# EAGLE design Solenoid_con (EAGLE 7.7.0)
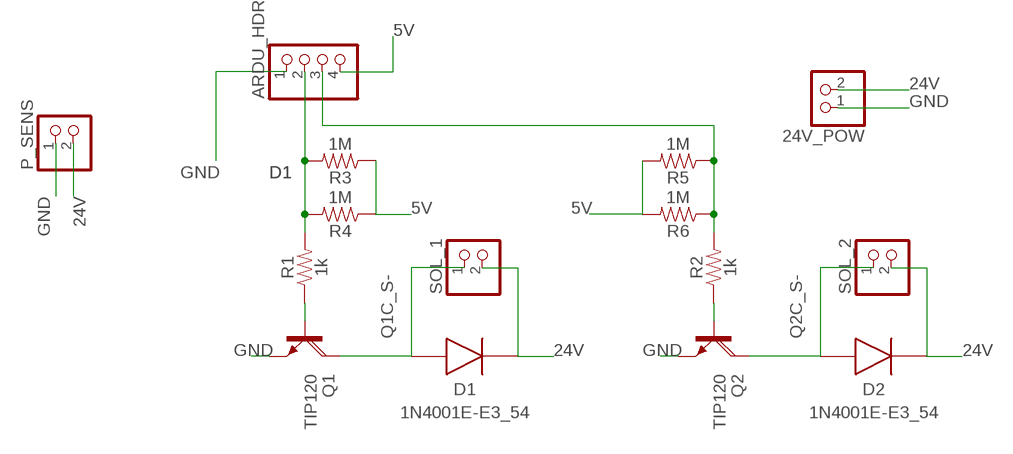
[diagram p0: schematic, sheet 1]

## Parts
24V_POW  PINHD-1X2  [1X02]
ARDU_HDR  PINHD-1X4  [1X04]
D1  1N4001E-E3_54  [DIOAD1405W86L465D235]
D2  1N4001E-E3_54  [DIOAD1405W86L465D235]
P_SENS  PINHD-1X2  [1X02]
Q1  TIP120  [TO220AH]
Q2  TIP120  [TO220AH]
R1  1k  1KOHM-HORIZ-1/4W-5%  [AXIAL-0.3]
R2  1k  1KOHM-HORIZ-1/4W-5%  [AXIAL-0.3]
R3  1M  1KOHM-HORIZ-1/4W-5%  [AXIAL-0.3]
R4  1M  1KOHM-HORIZ-1/4W-5%  [AXIAL-0.3]
R5  1M  1KOHM-HORIZ-1/4W-5%  [AXIAL-0.3]
R6  1M  1KOHM-HORIZ-1/4W-5%  [AXIAL-0.3]
SOL_1  PINHD-1X2  [1X02]
SOL_2  PINHD-1X2  [1X02]

## Nets
5V: ARDU_HDR.4 R3.P$1 R4.P$1 R5.P$2 R6.P$2
24V: 24V_POW.2 D1.2(K) D2.2(K) P_SENS.2 SOL_1.2 SOL_2.2
D1: ARDU_HDR.2 R1.P$2 R3.P$2 R4.P$2
D2: ARDU_HDR.3 R2.P$2 R5.P$1 R6.P$1
GND: 24V_POW.1 ARDU_HDR.1 P_SENS.1 Q1.E Q2.E
N$1: Q1.B R1.P$1
N$3: Q2.B R2.P$1
Q1C_S-: D1.1(A) Q1.C SOL_1.1
Q2C_S-: D2.1(A) Q2.C SOL_2.1

## Library data of the parts
24V_POW P_SENS SOL_1 SOL_2 = pinhead:PINHD-1X2: PIN HEADER
ARDU_HDR = pinhead:PINHD-1X4: PIN HEADER
D1 D2 = SamacSys_Parts:1N4001E-E3_54: Rectifiers Vr/50V Io/1A <https://componentsearchengine.com/Images/1/1N4001E-E3_54.jpg> Source: Datasheet <http://www.vishay.com/docs/88503/1n4001.pdf>; DESCRIPTION: Rectifiers Vr/50V Io/1A; HEIGHT: mm; MANUFACTURER_NAME: Vishay; MANUFACTURER_PART_NUMBER: 1N4001E-E3/54; SUPPLIER_NAME: RS
Q1 Q2 = transistor-power:TIP120: NPN DARLINGTON TRANSISTOR
R1 R2 = SparkFun-Resistors:1KOHM: 1kΩ resistor A resistor is a passive two-terminal electrical component that implements electrical resistance as a circuit element. Resistors act to reduce current flow, and, at the same time, act to lower voltage levels within circuits. - Wikipedia; PROD_ID: RES-08380
R3-R6 = SparkFun-Resistors:1KOHM: 1kΩ resistor A resistor is a passive two-terminal electrical component that implements electrical resistance as a circuit element. Resistors act to reduce current flow, and, at the same time, act to lower voltage levels within circuits. - Wikipedia; PROD_ID: RES-08380; VALUE: 1k

## Board
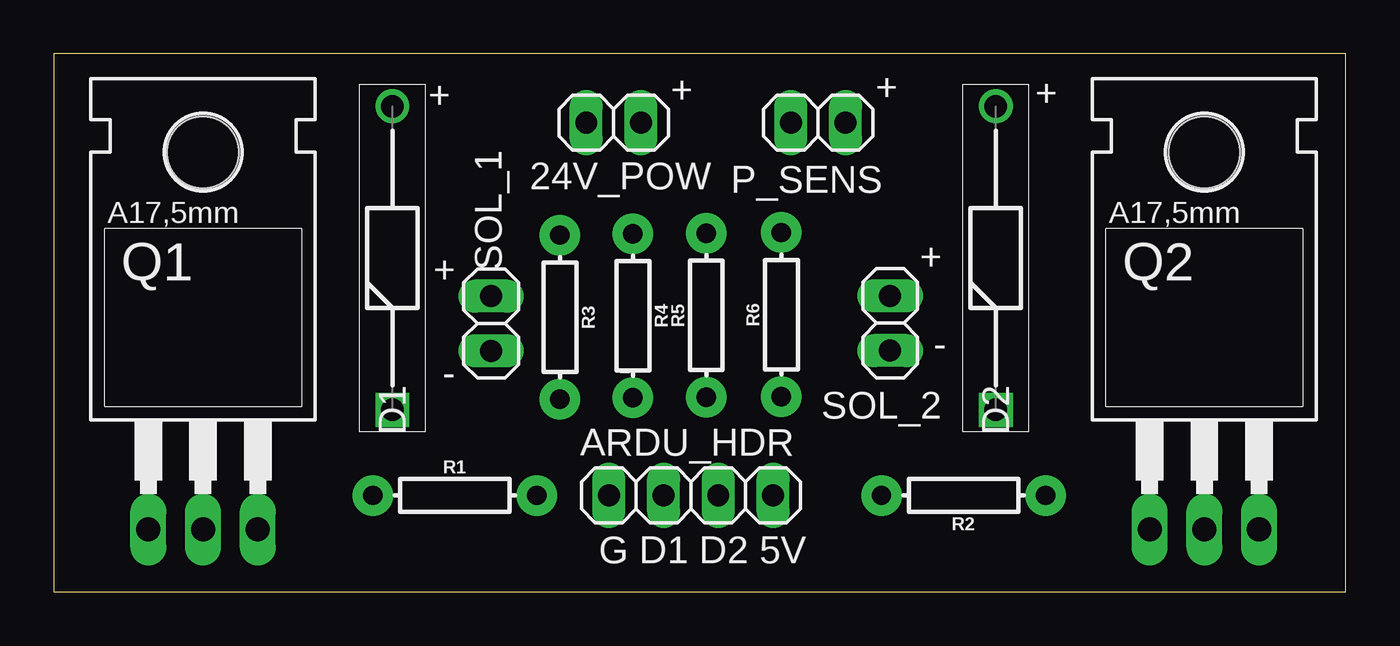
[diagram p1: board, top side]
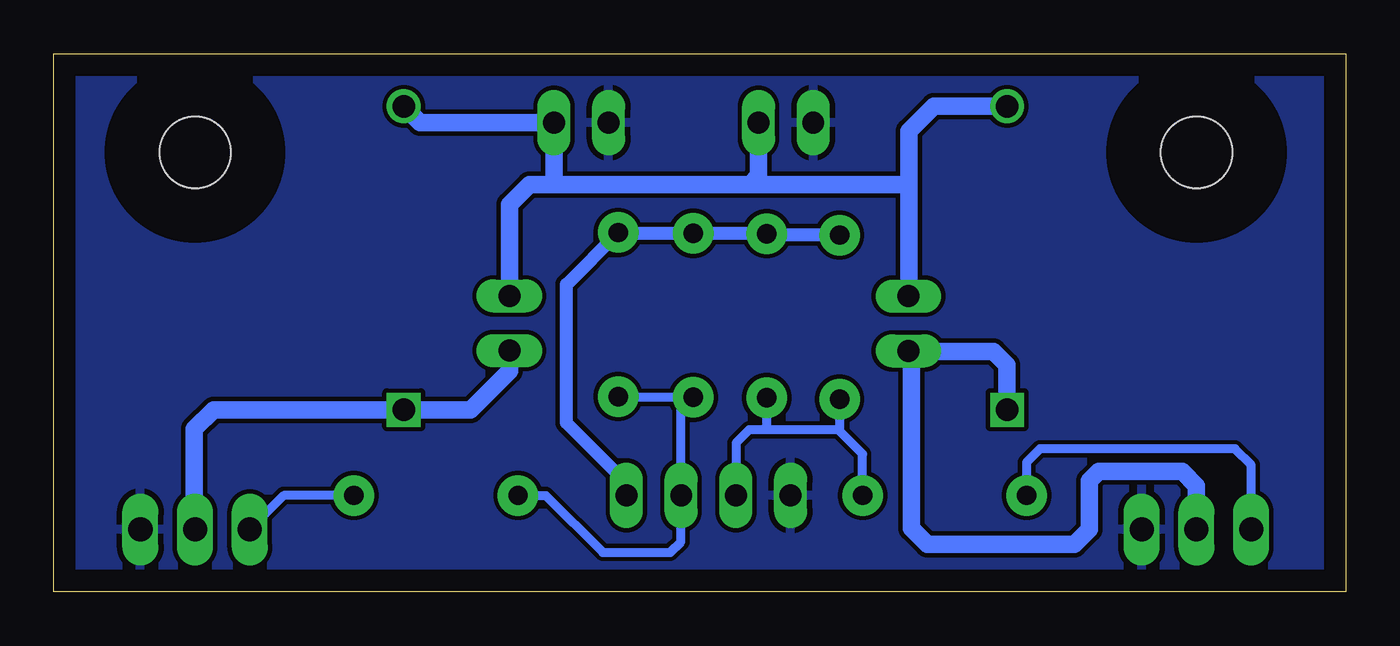
[diagram p2: board, bottom side, seen from below]

Size 60 x 25 mm. Coordinates in mm from the lower left corner, seen from the top.
Outline: 0,0 60,0 60,25 0,25 0,0
Copper layers (1*16): Top 0.035mm / dielectric 1.5mm / Bottom 0.035mm
Design rules "default": minimum track width 10mil, minimum drill 24mil, track to track 8mil, track to pad 8mil, pad to pad 8mil, via to via 8mil, smd to smd 8mil, copper to edge 40mil, drill to drill 8mil, minimum pad ring 10mil, minimum via ring 8mil, stop-mask expansion 4mil, vias tented up to drill 0mil, thermal gap 10mil

### Footprints (pad centres in the part's own frame; a part is rotated, then mirrored left to right if it is on the bottom)
1X02 = drill 1.016 long: 1 -1.27,0; 2 1.27,0
1X04 = drill 1.016 long: 1 -3.81,0; 2 -1.27,0; 3 1.27,0; 4 3.81,0
DIOAD1405W86L465D235 = drill 1.05 pad 1.575 square: 1 0,0 | drill 1.05 pad 1.575: 2 14.1,0
TO220AH = drill 1.118 long: B -2.54,-6.35; C 0,-6.35; E 2.54,-6.35 | hole 3.302: 0,11.176
AXIAL-0.3 = drill 0.9 pad 1.88: P$1 -3.81,0; P$2 3.81,0

### Placement (x,y rotation side)
24V_POW  26,21.8 0 top
ARDU_HDR  29.59,4.48 0 top
D1  15.72,8.46 90 top
D2  43.75,8.46 90 top
P_SENS  35.5,21.8 0 top
Q1  6.93,9.25 0 top
Q2  53.44,9.25 0 top
R1  18.63,4.48 0 top
R2  42.25,4.48 180 top
R3  23.51,12.77 270 top
R4  26.89,12.83 270 top
R5  30.3,12.85 90 top
R6  33.79,12.88 90 top
SOL_1  20.31,12.47 90 top
SOL_2  38.84,12.48 90 top

### Tracks (layer width: path | path; a pad name or v marks a point on that pad's centre or on a via)
5V
  Bottom 0.406: 26.83,16.58 R4.P$1 | 30.29,16.64 R5.P$2 | 33.76,16.66 R6.P$2
  Bottom 0.61: R3.P$1 26.83,16.58 | R4.P$1 30.29,16.64 | R5.P$2 33.76,16.66 | ARDU_HDR.4 33.4,5.06 36.2,7.86 36.2,14.29 R6.P$2
24V
  Bottom 0.406: 20.28,13.77 SOL_1.2
  Bottom 0.813: D1.2 19.13,22.56 20.28,21.41 20.28,18.9 | 20.28,18.9 20.28,13.77 | D2.2 42.99,21.8 P_SENS.2 36.77,19.13 36.97,18.93 | SOL_2.2 38.84,18 37.91,18.93 36.97,18.93 | 36.97,18.93 27.67,18.93 | 27.67,18.93 20.32,18.93 20.28,18.9 | 24V_POW.2 27.27,19.33 27.67,18.93
D1
  Bottom 0.406: R1.P$2 22.44,6.4 23.56,7.53 | 23.56,7.53 27.05,7.53 | 27.05,7.53 27.7,7.53 28.31,6.92 ARDU_HDR.2 | R4.P$2 26.89,7.68 27.05,7.53 | R3.P$2 23.51,7.58 23.56,7.53
D2
  Bottom 0.406: R6.P$1 33.76,9.04 R5.P$1 30.86,8.48 ARDU_HDR.3 30.88,4.47 30.88,2.33 31.38,1.83 34.5,1.83 37.15,4.48 R2.P$2
GND
  pour Bottom: 0.05,24.99 60.01,24.99 60.01,-0.1 0,-0.1 0,25.04
N$1
  Bottom 0.406: Q1.B 4.39,5.89 5.15,6.65 14.19,6.65 14.83,6.01 14.83,4.49 R1.P$1
N$3
  Bottom 0.406: R2.P$1 49.31,4.48 Q2.B
Q1C_S-
  Bottom 0.406: 20.17,11.05 SOL_1.1 20.29,11.18
  Bottom 0.813: Q1.C 6.93,4.93 7.59,5.59 11.47,5.59 11.91,5.15 11.91,2.9 12.6,2.21 19.42,2.21 20.17,2.96 20.17,11.05 | D1.1 15.72,10.54 16.36,11.18 20.29,11.18
Q2C_S-
  Bottom 0.406: 53.47,2.93 Q2.C
  Bottom 0.813: 53.47,2.93 53.47,7.57 52.58,8.46 D2.1 40.66,8.46 38.84,10.28 SOL_2.1

### Text on the board
tNames: + | + | + | + | + | + | - | - | - | G D1 D2 5V